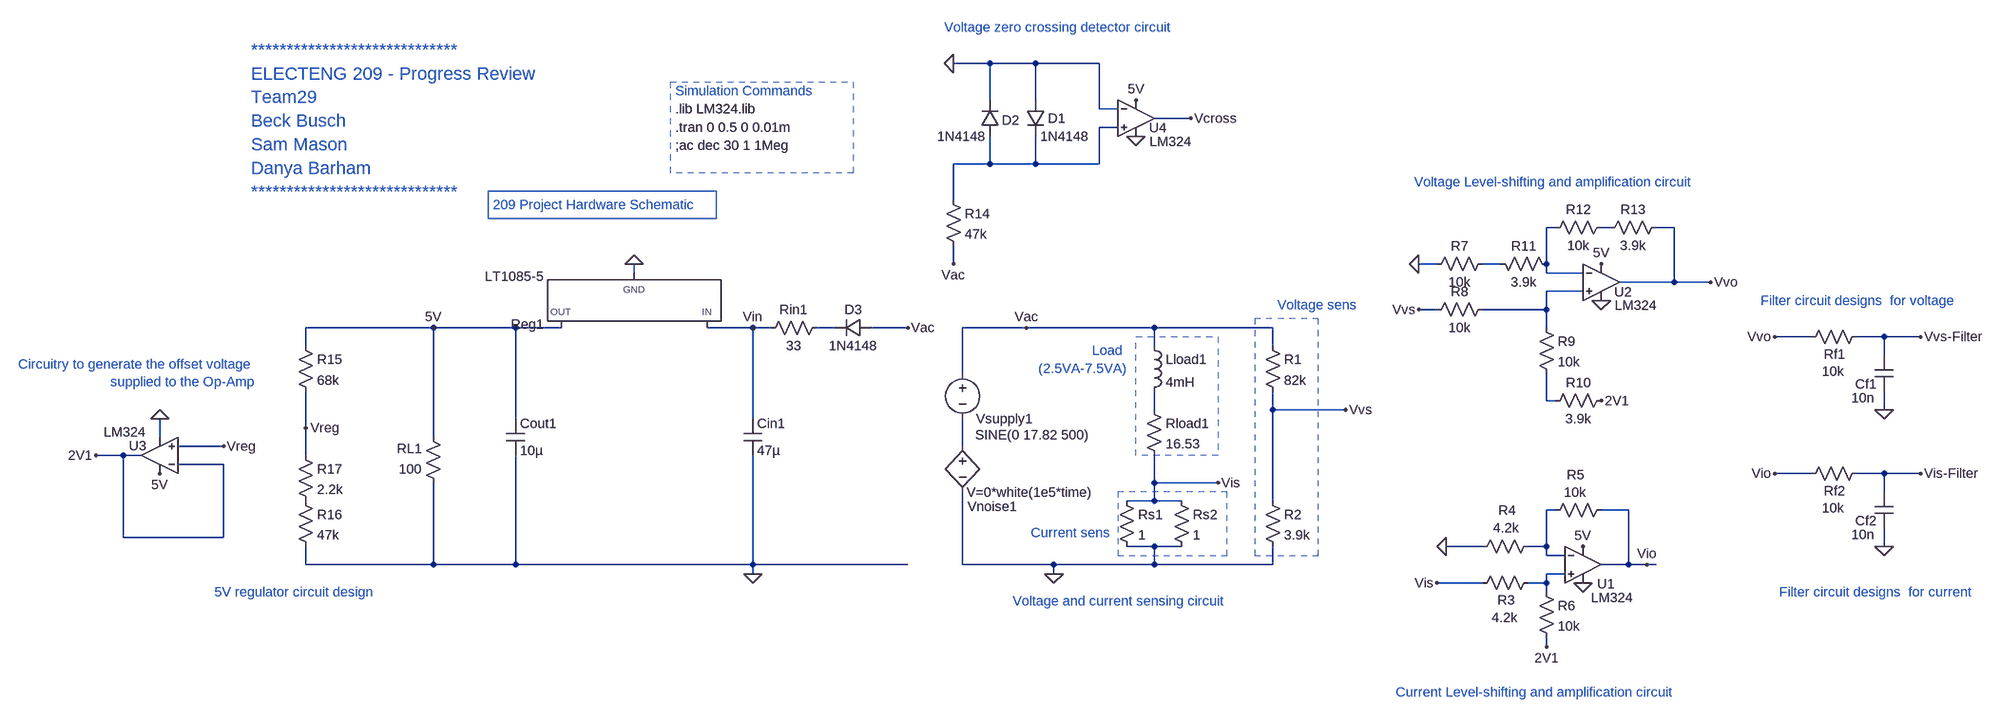
[diagram p0: schematic Beck arranged.asc]
Beck arranged.asc, the LTspice schematic file:
Version 4
SHEET 1 4512 932
WIRE 1632 -656 1568 -656
WIRE 1712 -656 1632 -656
WIRE 1824 -656 1712 -656
WIRE 1632 -592 1632 -656
WIRE 1712 -592 1712 -656
WIRE 1824 -576 1824 -656
WIRE 1856 -576 1824 -576
WIRE 1984 -560 1920 -560
WIRE 1856 -544 1824 -544
WIRE 1632 -480 1632 -528
WIRE 1632 -480 1568 -480
WIRE 1712 -480 1712 -528
WIRE 1712 -480 1632 -480
WIRE 1824 -480 1824 -544
WIRE 1824 -480 1712 -480
WIRE 1568 -416 1568 -480
WIRE 2624 -368 2608 -368
WIRE 2720 -368 2704 -368
WIRE 2832 -368 2800 -368
WIRE 1568 -304 1568 -336
WIRE 2416 -304 2384 -304
WIRE 2528 -304 2496 -304
WIRE 2608 -304 2608 -368
WIRE 1008 -288 1008 -304
WIRE 2608 -288 2608 -304
WIRE 2672 -288 2608 -288
WIRE 2832 -272 2832 -368
WIRE 2832 -272 2736 -272
WIRE 2896 -272 2832 -272
WIRE 2672 -256 2608 -256
WIRE 2416 -224 2384 -224
WIRE 2608 -224 2608 -256
WIRE 2608 -224 2496 -224
WIRE 656 -192 432 -192
WIRE 800 -192 656 -192
WIRE 880 -192 800 -192
WIRE 1216 -192 1136 -192
WIRE 1248 -192 1216 -192
WIRE 1360 -192 1328 -192
WIRE 1488 -192 1424 -192
WIRE 1696 -192 1584 -192
WIRE 1920 -192 1696 -192
WIRE 2128 -192 1920 -192
WIRE 2608 -192 2608 -224
WIRE 3072 -176 3008 -176
WIRE 3200 -176 3152 -176
WIRE 3264 -176 3200 -176
WIRE 432 -160 432 -192
WIRE 1920 -160 1920 -192
WIRE 2128 -160 2128 -192
WIRE 3200 -144 3200 -176
WIRE 1584 -112 1584 -192
WIRE 2608 -64 2608 -112
WIRE 2624 -64 2608 -64
WIRE 1920 -48 1920 -80
WIRE 2128 -48 2128 -80
WIRE 2256 -48 2128 -48
WIRE 3200 -48 3200 -80
WIRE 800 -32 800 -192
WIRE 1216 -32 1216 -192
WIRE 432 -16 432 -80
WIRE 176 0 176 -32
WIRE 656 0 656 -192
WIRE 288 16 208 16
WIRE 1584 16 1584 -32
WIRE 112 32 64 32
WIRE 144 32 112 32
WIRE 432 32 432 -16
WIRE 288 48 208 48
WIRE 3072 64 3008 64
WIRE 3200 64 3152 64
WIRE 3264 64 3200 64
WIRE 1920 80 1920 32
WIRE 2032 80 1920 80
WIRE 3200 96 3200 64
WIRE 1920 112 1920 80
WIRE 1920 112 1872 112
WIRE 1968 112 1920 112
WIRE 2128 112 2128 -48
WIRE 2624 128 2608 128
WIRE 2752 128 2704 128
WIRE 112 176 112 32
WIRE 288 176 288 48
WIRE 288 176 112 176
WIRE 1920 192 1872 192
WIRE 1968 192 1920 192
WIRE 2496 192 2432 192
WIRE 2608 192 2608 128
WIRE 2608 192 2576 192
WIRE 3200 192 3200 160
WIRE 2608 208 2608 192
WIRE 2640 208 2608 208
WIRE 432 224 432 192
WIRE 656 224 656 80
WIRE 656 224 432 224
WIRE 800 224 800 32
WIRE 800 224 656 224
WIRE 1216 224 1216 32
WIRE 1216 224 800 224
WIRE 1488 224 1216 224
WIRE 1584 224 1584 96
WIRE 1744 224 1584 224
WIRE 1920 224 1920 192
WIRE 1920 224 1744 224
WIRE 2128 224 2128 192
WIRE 2128 224 1920 224
WIRE 2752 224 2752 128
WIRE 2752 224 2704 224
WIRE 2784 224 2752 224
WIRE 2800 224 2784 224
WIRE 1216 240 1216 224
WIRE 1744 240 1744 224
WIRE 2640 240 2608 240
WIRE 2496 256 2416 256
WIRE 2608 256 2608 240
WIRE 2608 256 2576 256
WIRE 2608 272 2608 256
WIRE 2608 368 2608 352
FLAG 1696 -192 Vac
FLAG 2032 80 Vis
FLAG 1744 240 0
FLAG 2672 256 0
FLAG 2672 192 5V
FLAG 2784 224 Vio
FLAG 2608 368 2V1
FLAG 2432 192 0
FLAG 2416 256 Vis
FLAG 2384 -304 0
FLAG 2704 -304 5V
FLAG 2704 -240 0
FLAG 2704 -64 2V1
FLAG 2896 -272 Vvo
FLAG 2384 -224 Vvs
FLAG 2256 -48 Vvs
FLAG 3200 -48 0
FLAG 3264 -176 Vvs-Filter
FLAG 3200 192 0
FLAG 3264 64 Vis-Filter
FLAG 3008 -176 Vvo
FLAG 3008 64 Vio
FLAG 1568 -656 0
FLAG 176 -32 0
FLAG 176 64 5V
FLAG 64 32 2V1
FLAG 1216 -192 Vin
FLAG 656 -192 5V
FLAG 1008 -304 0
FLAG 1488 -192 Vac
FLAG 1568 -304 Vac
FLAG 1888 -528 0
FLAG 1888 -592 5V
FLAG 1984 -560 Vcross
FLAG 1216 240 0
FLAG 432 -16 Vreg
FLAG 288 16 Vreg
SYMBOL voltage 1584 -128 R0
WINDOW 0 24 96 Left 2
WINDOW 3 22 124 Left 2
WINDOW 123 0 0 Left 0
WINDOW 39 0 0 Left 0
SYMATTR InstName Vsupply1
SYMATTR Value SINE(0 17.82 500)
SYMBOL res 1904 -64 R0
SYMATTR InstName Rload1
SYMATTR Value 16.53
SYMBOL ind 1904 -176 R0
SYMATTR InstName Lload1
SYMATTR Value 4mH
SYMBOL res 1856 96 R0
SYMATTR InstName Rs1
SYMATTR Value 1
SYMBOL res 1952 96 R0
SYMATTR InstName Rs2
SYMATTR Value 1
SYMBOL res 2112 -176 R0
SYMATTR InstName R1
SYMATTR Value 82k
SYMBOL res 2112 96 R0
SYMATTR InstName R2
SYMATTR Value 3.9k
SYMBOL bv 1584 0 R0
WINDOW 0 9 122 Left 2
WINDOW 3 7 97 Left 2
SYMATTR InstName Vnoise1
SYMATTR Value V=0*white(1e5*time)
SYMBOL Opamps/opamp2 2672 160 R0
WINDOW 0 25 98 Left 2
WINDOW 3 14 122 Left 2
SYMATTR InstName U1
SYMATTR Value LM324
SYMBOL res 2592 240 R90
WINDOW 0 62 55 VBottom 2
WINDOW 3 61 57 VTop 2
SYMATTR InstName R3
SYMATTR Value 4.2k
SYMBOL res 2592 176 R90
WINDOW 0 -32 53 VBottom 2
WINDOW 3 -32 55 VTop 2
SYMATTR InstName R4
SYMATTR Value 4.2k
SYMBOL res 2720 112 R90
WINDOW 0 -30 61 VBottom 2
WINDOW 3 -31 62 VTop 2
SYMATTR InstName R5
SYMATTR Value 10k
SYMBOL res 2592 256 R0
SYMATTR InstName R6
SYMATTR Value 10k
SYMBOL res 2512 -320 R90
WINDOW 0 0 56 VBottom 2
WINDOW 3 32 56 VTop 2
SYMATTR InstName R7
SYMATTR Value 10k
SYMBOL res 2512 -240 R90
WINDOW 0 0 56 VBottom 2
WINDOW 3 32 56 VTop 2
SYMATTR InstName R8
SYMATTR Value 10k
SYMBOL res 2592 -208 R0
SYMATTR InstName R9
SYMATTR Value 10k
SYMBOL res 2720 -80 R90
WINDOW 0 0 56 VBottom 2
WINDOW 3 32 56 VTop 2
SYMATTR InstName R10
SYMATTR Value 3.9k
SYMBOL res 2512 -320 M90
WINDOW 0 0 56 VBottom 2
WINDOW 3 32 56 VTop 2
SYMATTR InstName R11
SYMATTR Value 3.9k
SYMBOL res 2720 -384 R90
WINDOW 0 0 56 VBottom 2
WINDOW 3 32 56 VTop 2
SYMATTR InstName R12
SYMATTR Value 10k
SYMBOL res 2816 -384 R90
WINDOW 0 0 56 VBottom 2
WINDOW 3 32 56 VTop 2
SYMATTR InstName R13
SYMATTR Value 3.9k
SYMBOL Opamps/opamp2 2704 -336 R0
WINDOW 0 23 81 Left 2
WINDOW 3 24 105 Left 2
SYMATTR InstName U2
SYMATTR Value LM324
SYMBOL res 3168 -192 R90
WINDOW 0 62 55 VBottom 2
WINDOW 3 61 57 VTop 2
SYMATTR InstName Rf1
SYMATTR Value 10k
SYMBOL cap 3216 -80 R180
WINDOW 0 29 13 Left 2
WINDOW 3 33 -11 Left 2
SYMATTR InstName Cf1
SYMATTR Value 10n
SYMBOL res 3168 48 R90
WINDOW 0 62 55 VBottom 2
WINDOW 3 61 57 VTop 2
SYMATTR InstName Rf2
SYMATTR Value 10k
SYMBOL cap 3216 160 R180
WINDOW 0 29 13 Left 2
WINDOW 3 33 -11 Left 2
SYMATTR InstName Cf2
SYMATTR Value 10n
SYMBOL diode 1696 -592 R0
WINDOW 0 38 32 Left 2
SYMATTR InstName D1
SYMATTR Value 1N4148
SYMBOL res 1552 -432 R0
SYMATTR InstName R14
SYMATTR Value 47k
SYMBOL diode 1648 -528 R180
WINDOW 0 -36 28 Left 2
WINDOW 3 24 0 Left 2
SYMATTR InstName D2
SYMATTR Value 1N4148
SYMBOL Opamps/opamp2 176 96 R180
WINDOW 0 23 81 Left 2
WINDOW 3 24 105 Left 2
SYMATTR InstName U3
SYMATTR Value LM324
SYMBOL res 1232 -176 R270
WINDOW 0 32 56 VTop 2
WINDOW 3 0 56 VBottom 2
SYMATTR InstName Rin1
SYMATTR Value 33
SYMBOL diode 1424 -208 R90
WINDOW 0 0 32 VBottom 2
WINDOW 3 32 32 VTop 2
SYMATTR InstName D3
SYMATTR Value 1N4148
SYMBOL cap 1200 -32 R0
SYMATTR InstName Cin1
SYMATTR Value 47µ
SYMATTR SpiceLine Rser=0.001
SYMBOL cap 784 -32 R0
SYMATTR InstName Cout1
SYMATTR Value 10µ
SYMATTR SpiceLine Rser=0.001
SYMBOL res 672 96 R180
WINDOW 0 36 76 Left 2
WINDOW 3 36 40 Left 2
SYMATTR InstName RL1
SYMATTR Value 100
SYMBOL PowerProducts/LT1085-5 1008 -192 R180
SYMATTR InstName Reg1
SYMBOL res 416 -176 R0
SYMATTR InstName R15
SYMATTR Value 68k
SYMBOL res 416 96 R0
SYMATTR InstName R16
SYMATTR Value 47k
SYMBOL res 416 16 R0
SYMATTR InstName R17
SYMATTR Value 2.2k
SYMBOL Opamps/opamp2 1888 -624 R0
WINDOW 0 23 81 Left 2
WINDOW 3 24 105 Left 2
SYMATTR InstName U4
SYMATTR Value LM324
TEXT 336 -680 Left 3 ;*****************************\nELECTENG 209 - Progress Review\nTeam29\nBeck Busch\nSam Mason\nDanya Barham\n*****************************
TEXT 1872 -152 Right 2 ;Load \n(2.5VA-7.5VA)
TEXT 1080 -512 Left 2 !;ac dec 30 1 1Meg
TEXT 1080 -608 Left 2 ;Simulation Commands
TEXT 1080 -544 Left 2 !.tran 0 0.5 0 0.01m
TEXT 1080 -576 Left 2 !.lib LM324.lib
TEXT 1672 288 Left 2 ;Voltage and current sensing circuit
TEXT 2344 448 Left 2 ;Current Level-shifting and amplification circuit
TEXT 2376 -448 Left 2 ;Voltage Level-shifting and amplification circuit
TEXT 2984 -240 Left 2 ;Filter circuit designs  for voltage
TEXT 3016 272 Left 2 ;Filter circuit designs  for current
TEXT 272 272 Left 2 ;5V regulator circuit design
TEXT 344 -128 Right 2 ;Circuitry to generate the offset voltage \nsupplied to the Op-Amp
TEXT 1552 -720 Left 2 ;Voltage zero crossing detector circuit
TEXT 1704 168 Left 2 ;Current sens
TEXT 2136 -232 Left 2 ;Voltage sens
TEXT 760 -408 Left 2 ;209 Project Hardware Schematic
RECTANGLE Normal 1392 -464 1072 -624 2
RECTANGLE Normal 2032 32 1888 -176 2
RECTANGLE Normal 1856 208 2048 96 2
RECTANGLE Normal 2208 -208 2096 208 2
RECTANGLE Normal 1152 -384 752 -432

The netlist it stands for:
* Beck arranged.asc
Vsupply1 Vac N009 SINE(0 17.82 500)
Rload1 N008 Vis 16.53
Lload1 Vac N008 4mH
Rs1 Vis 0 1
Rs2 Vis 0 1
R1 Vac Vvs 82k
R2 Vvs 0 3.9k
B§Vnoise1 N009 0 V=0*white(1e5*time)
XU1 N011 N010 5V 0 Vio LM324  ; pins In+ In- V+ V- OUT
R3 N011 Vis 4.2k
R4 N010 0 4.2k
R5 Vio N010 10k
R6 N011 2V1 10k
R7 N004 0 10k
R8 N005 Vvs 10k
R9 N005 N007 10k
R10 2V1 N007 3.9k
R11 N004 N002 3.9k
R12 N003 N002 10k
R13 Vvo N003 3.9k
XU2 N005 N002 5V 0 Vvo LM324  ; pins In+ In- V+ V- OUT
Rf1 Vvs-Filter Vvo 10k
Cf1 0 Vvs-Filter 10n
Rf2 Vis-Filter Vio 10k
Cf2 0 Vis-Filter 10n
D1 0 N001 1N4148
R14 N001 Vac 47k
D2 N001 0 1N4148
XU3 Vreg 2V1 5V 0 2V1 LM324  ; pins In+ In- V+ V- OUT
Rin1 Vin N006 33
D3 Vac N006 1N4148
Cin1 Vin 0 47µ Rser=0.001
Cout1 5V 0 10µ Rser=0.001
RL1 0 5V 100
XReg1 0 5V Vin LT1085-5  ; pins GND OUT IN
R15 5V Vreg 68k
R16 P001 0 47k
R17 Vreg P001 2.2k
XU4 N001 0 5V 0 Vcross LM324  ; pins In+ In- V+ V- OUT
.model D D
.lib standard.dio
* *****************************
* ELECTENG 209 - Progress Review
* Team29
* Beck Busch
* Sam Mason
* Danya Barham
* *****************************
* Load
* (2.5VA-7.5VA)
;ac dec 30 1 1Meg
* Simulation Commands
.tran 0 0.5 0 0.01m
.lib LM324.lib
* Voltage and current sensing circuit
* Current Level-shifting and amplification circuit
* Voltage Level-shifting and amplification circuit
* Filter circuit designs  for voltage
* Filter circuit designs  for current
* 5V regulator circuit design
* Circuitry to generate the offset voltage
* supplied to the Op-Amp
* Voltage zero crossing detector circuit
* Current sens
* Voltage sens
* 209 Project Hardware Schematic
.backanno
.end